# EAGLE design board_V2 (EAGLE 9.3.1)
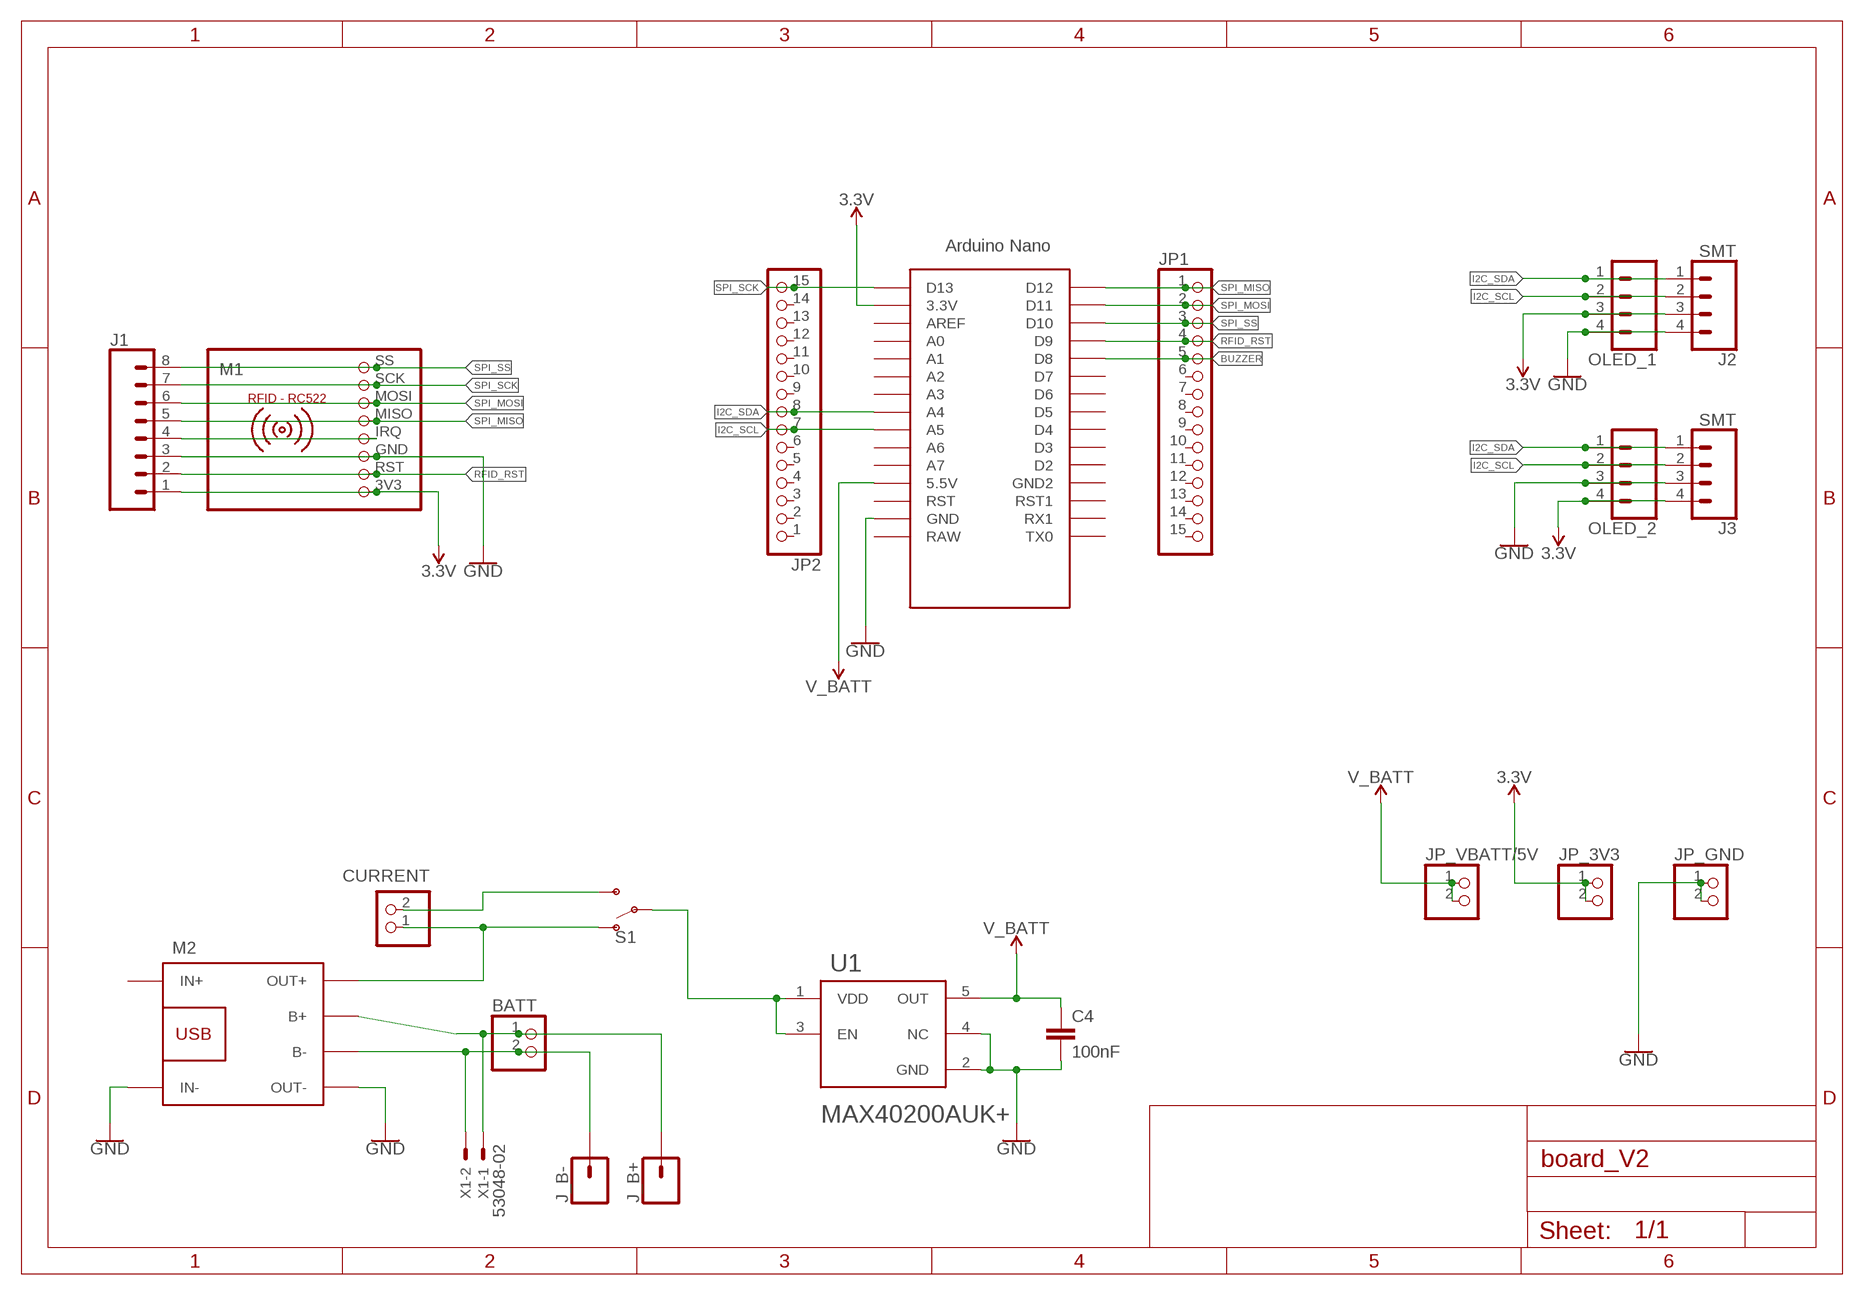
[diagram p0: schematic, sheet 1]

## Parts
BATT  PINHD-1X2  [1X02]
C4  100nF  C-EUC0805  [C0805]
CURRENT  PINHD-1X2  [1X02]
J1  CONN_08SMD-COMBO-FEMALE  [1X08_SMD_COMBINED]
J2  SMT  CONN_04SMD_STRAIGHT_COMBO  [1X04_SMD_VERTICAL_COMBO]
J3  SMT  CONN_04SMD_STRAIGHT_COMBO  [1X04_SMD_VERTICAL_COMBO]
J_B+  CONN_01OFFSET  [1X01_OFFSET]
J_B-  CONN_01OFFSET  [1X01_OFFSET]
JP1  PINHD-1X151X15_SMT  [1X15_SMT]
JP2  PINHD-1X151X15_SMT  [1X15_SMT]
JP_3V3  PINHD-1X2  [1X02]
JP_GND  PINHD-1X2  [1X02]
JP_VBATT/5V  PINHD-1X2  [1X02]
M1  RFID-RC522  [RFID-RC522]
M2  BATTERY-CHARGER-LI-PROT  [BATTERY-CHARGER-LI-PROT]
OLED_1  CONN_04  [1X04]
OLED_2  CONN_04  [1X04]
S1  SWITCH-SPDT-PTH-11.6X4.0MM  [SWITCH_SPDT_PTH_11.6X4.0MM]
U1  MAXIM_ELECTRONICS_MAX40200AUK+MAXIM_ELECTRONICS_MAX40200AUK+_0_0  [MAXIM_ELECTRONICS_MAX40200AUK+_0]
U$1  NANO_ICSP-REMOVED  [NANO_ICSP-REMOVED]
X1  53048-02  [53048-02]

## Nets
3.3V [power]: J1.1 J2.3 J3.4 JP_3V3.1 JP_3V3.2 M1.3V3 OLED_1.3 OLED_2.4 U$1.3.3V
BATT_VOUT [power]: S1.2(P) U1.1(VDD) U1.3(EN)
BUZZER: JP1.5 U$1.D8
GND [power]: C4.2 J1.3 J2.4 J3.3 JP_GND.1 JP_GND.2 M1.GND M2.IN- M2.OUT- OLED_1.4 OLED_2.3 U1.2(GND) U1.4(NC) U$1.GND
I2C_SCL: J2.2 J3.2 JP2.7 OLED_1.2 OLED_2.2 U$1.A5
I2C_SDA: J2.1 J3.1 JP2.8 OLED_1.1 OLED_2.1 U$1.A4
N$1 [power]: BATT.1 J_B+.1 M2.B+ X1.1
N$2 [power]: CURRENT.1 M2.OUT+ S1.1(O)
N$3: J1.4 M1.IRQ
N$4 [power]: CURRENT.2 S1.3(S)
N$5 [power]: BATT.2 J_B-.1 M2.B- X1.2
RFID_RST: J1.2 JP1.4 M1.RST U$1.D9
SPI_MISO: J1.5 JP1.1 M1.MISO U$1.D12
SPI_MOSI: J1.6 JP1.2 M1.MOSI U$1.D11
SPI_SCK: J1.7 JP2.15 M1.SCK U$1.D13
SPI_SS: J1.8 JP1.3 M1.SS U$1.D10
V_BATT [power]: C4.1 JP_VBATT/5V.1 JP_VBATT/5V.2 U1.5(OUT) U$1.5V(5.5V)
Unconnected: JP1.6 JP1.7 JP1.8 JP1.9 JP1.10 JP1.11 JP1.12 JP1.13 JP1.14 JP1.15 JP2.1 JP2.2 JP2.3 JP2.4 JP2.5 JP2.6 JP2.9 JP2.10 JP2.11 JP2.12 JP2.13 JP2.14 M2.IN+ U$1.A0 U$1.A1 U$1.A2 U$1.A3 U$1.A6 U$1.A7 U$1.AREF U$1.D2 U$1.D3 U$1.D4 U$1.D5 U$1.D6 U$1.D7 U$1.GND1(GND2) U$1.RAW U$1.RST U$1.RST1 U$1.RX1 U$1.TX0

## Library data of the parts
BATT CURRENT JP_3V3 JP_GND JP_VBATT/5V = pinhead:PINHD-1X2: PIN HEADER
C4 = rcl:C-EU: CAPACITOR, European symbol; SPICEPREFIX: C
J1 = SparkFun-Connectors:CONN_08: Multi connection point. Often used as Generic Header-pin footprint for 0.1 inch spaced/style header connections On any of the 0.1 inch spaced packages, you can populate with these: Break Away Headers - Straight <https://www.sparkfun.com/products/116> (PRT-00116) Break Away Male Headers - Right Angle <https://www.sparkfun.com/products/553> (PRT-00553) Female Headers <https://www.sparkfun.com/products/115> (PRT-00115) Break Away Headers - Machine Pin <https://www.sparkfun.com/products/117> (PRT-00117) Break Away Female Headers - Swiss Machine Pin <https://www.sparkfun.com/products/743> (PRT-00743) Arduino Stackable Header - 8 Pin <https://www.sparkfun.com/products/9279> (PRT-09279) For SCREWTERMINALS and SPRING TERMINALS visit here: Screw Terimnals on SparkFun.com <https://www.sparkfun.com/search/results?term=Screw+Terminals> (5mm/3.5mm/2.54mm spacing) This device is also useful as a general connection point to wire up your design to another part of your project. Our various solder wires solder well into these plated through hole pads. Hook-Up Wire - Assortment (Stranded, 22 AWG) <https://www.sparkfun.com/products/11375> (PRT-11375) Hook-Up Wire - Assortment (Solid Core, 22 AWG) <https://www.sparkfun.com/products/11367> (PRT-11367) View the entire wire category on our website here <https://www.sparkfun.com/categories/141> Special notes: Molex polarized connector foot print use with SKU : PRT-08231 with associated crimp pins and housings. 1MM SMD Version SKU: PRT-10208 NOTES ON THE VARIANTS LOCK and LOCK_LONGPADS... This footprint was designed to help hold the alignment of a through-hole component (i.e. 6-pin header) while soldering it into place. You may notice that each hole has been shifted either up or down by 0.005 of an inch from it's more standard position (which is a perfectly straight line). This slight alteration caused the pins (the squares in the middle) to touch the edges of the holes. Because they are alternating, it causes a "brace" to hold the component in place. 0.005 has proven to be the perfect amount of "off-center" position when using our standard breakaway headers. Although looks a little odd when you look at the bare footprint, once you have a header in there, the alteration is very hard to notice. Also,if you push a header all the way into place, it is covered up entirely on the bottom side.; PROD_ID: CONN-10204; SF_ID: PRT-11543
J2 J3 = SparkFun-Connectors:CONN_04: Multi connection point. Often used as Generic Header-pin footprint for 0.1 inch spaced/style header connections On any of the 0.1 inch spaced packages, you can populate with these: Break Away Headers - Straight <https://www.sparkfun.com/products/116> (PRT-00116) Break Away Male Headers - Right Angle <https://www.sparkfun.com/products/553> (PRT-00553) Female Headers <https://www.sparkfun.com/products/115> (PRT-00115) Break Away Headers - Machine Pin <https://www.sparkfun.com/products/117> (PRT-00117) Break Away Female Headers - Swiss Machine Pin <https://www.sparkfun.com/products/743> (PRT-00743) For SCREWTERMINALS and SPRING TERMINALS visit here: Screw Terimnals on SparkFun.com <https://www.sparkfun.com/search/results?term=Screw+Terminals> (5mm/3.5mm/2.54mm spacing) This device is also useful as a general connection point to wire up your design to another part of your project. Our various solder wires solder well into these plated through hole pads. Hook-Up Wire - Assortment (Stranded, 22 AWG) <https://www.sparkfun.com/products/11375> (PRT-11375) Hook-Up Wire - Assortment (Solid Core, 22 AWG) <https://www.sparkfun.com/products/11367> (PRT-11367) View the entire wire category on our website here <https://www.sparkfun.com/categories/141> Special notes: Molex polarized connector foot print use with SKU : PRT-08231 with associated crimp pins and housings. 1MM SMD Version SKU: PRT-10208; PROD_ID: CONN-08511; VALUE: 1X04_SMD_STRAIGHT_COMBO
J_B+ J_B- = SparkFun-Connectors:CONN_01: Single connection point. Often used as Generic Header-pin footprint for 0.1 inch spaced/style header connections On any of the 0.1 inch spaced packages, you can populate with these: Break Away Headers - Straight <https://www.sparkfun.com/products/116> (PRT-00116) Break Away Male Headers - Right Angle <https://www.sparkfun.com/products/553> (PRT-00553) Female Headers <https://www.sparkfun.com/products/115> (PRT-00115) Break Away Headers - Machine Pin <https://www.sparkfun.com/products/117> (PRT-00117) Break Away Female Headers - Swiss Machine Pin <https://www.sparkfun.com/products/743> (PRT-00743) This device is also useful as a general connection point to wire up your design to another part of your project. Our various solder wires solder well into these plated through hole pads. Hook-Up Wire - Assortment (Stranded, 22 AWG) <https://www.sparkfun.com/products/11375> (PRT-11375) Hook-Up Wire - Assortment (Solid Core, 22 AWG) <https://www.sparkfun.com/products/11367> (PRT-11367) View the entire wire category on our website here <https://www.sparkfun.com/categories/141> Special notes: SMTSO-256-ET is a "flush mount" nut for a 4-40 screw. We mostly use this on specialty testbeds; it is a nice way to connect hardware to your PCB at an adjustable hieght. Also note, the SNAP packages are for using a snappable style connector. We sell a baggie of snaps and they are also used on two LilyPad designs: Snap Assortment - 30 pack (male and female) <https://www.sparkfun.com/products/11347> (DEV-11347) LilyPad Arduino SimpleSnap <https://www.sparkfun.com/products/10941> (DEV-10941) LilyPad SimpleSnap Protoboard <https://www.sparkfun.com/products/10940> (DEV-10940)
JP1 JP2 = pinhead+:PINHD-1X15: PIN HEADER
M1 = mfrc522-module:RFID-RC522: RFID-RC522 MFRC-522 based breakout board
M2 = diy-modules:BATTERY-CHARGER-LI-PROT: Lithium Battery 5V Charger with protection circuit More details available here: http://www.instructables.com/id/DIY-Lithium-ion-Battery-Charger/step4/TP4056-based-lithium-ion-battery-charger-module/ Click here to find device on ebay.com <http://www.ebay.com/sch/tp4056+charger+usb+protection>
OLED_1 OLED_2 = SparkFun-Connectors:CONN_04: Multi connection point. Often used as Generic Header-pin footprint for 0.1 inch spaced/style header connections On any of the 0.1 inch spaced packages, you can populate with these: Break Away Headers - Straight <https://www.sparkfun.com/products/116> (PRT-00116) Break Away Male Headers - Right Angle <https://www.sparkfun.com/products/553> (PRT-00553) Female Headers <https://www.sparkfun.com/products/115> (PRT-00115) Break Away Headers - Machine Pin <https://www.sparkfun.com/products/117> (PRT-00117) Break Away Female Headers - Swiss Machine Pin <https://www.sparkfun.com/products/743> (PRT-00743) For SCREWTERMINALS and SPRING TERMINALS visit here: Screw Terimnals on SparkFun.com <https://www.sparkfun.com/search/results?term=Screw+Terminals> (5mm/3.5mm/2.54mm spacing) This device is also useful as a general connection point to wire up your design to another part of your project. Our various solder wires solder well into these plated through hole pads. Hook-Up Wire - Assortment (Stranded, 22 AWG) <https://www.sparkfun.com/products/11375> (PRT-11375) Hook-Up Wire - Assortment (Solid Core, 22 AWG) <https://www.sparkfun.com/products/11367> (PRT-11367) View the entire wire category on our website here <https://www.sparkfun.com/categories/141> Special notes: Molex polarized connector foot print use with SKU : PRT-08231 with associated crimp pins and housings. 1MM SMD Version SKU: PRT-10208; PROD_ID: CONN-09696
S1 = SparkFun-Switches:SWITCH-SPDT: Single Pole, Double Throw (SPDT) Switch Single-pole, double-throw (SPDT) switch. Variant Overview SMD-AYZ0202 Surface Mount DPDT Switch <https://www.sparkfun.com/products/597> (COM-00597) Used on e.g. LilyPad Arduino USB - ATmega32U4 Board <https://www.sparkfun.com/products/12049> PTH-11.6X4.0MM SPDT Mini Power Switch <https://www.sparkfun.com/products/102> (COM-00102) Used on e.g. SparkFun Simon Says - Through-Hole Soldering Kit <https://www.sparkfun.com/products/10547> (KIT-10547) PTH-11.6X4.0MM-KIT KIT version of SPDT Mini Power Switch - Simplifies soldering by removing tStop of switch pins - only one side can be soldered. PTH-11.6X4.0MM-LOCK LOCK version of SPDT Mini Power Switch - Offset pins hold switch in place for easier soldering. SMD-RIGHT-ANGLE Surface Mount Right Angle Switch <https://www.sparkfun.com/products/10860> (COM-10860) Used on e.g. SparkFun ESP8266 Thing <https://www.sparkfun.com/products/13231>; PROD_ID: SWCH-08261; SF_SKU: COM-00102
U1 = Maxim Electronics - MAX40200AUK+:MAXIM_ELECTRONICS_MAX40200AUK+: IDEAL DIODE CURRENT SW, 5.5V, SOT23-5; CENTROID_NOT_SPECIFIED: No; DATASHEET: https://datasheets.maximintegrated.com/en/ds/MAX40200.pdf; DEVICE_CLASS_L1: Integrated Circuits (ICs); DEVICE_CLASS_L2: Power Management ICs; DEVICE_CLASS_L3: unset; DIGIKEY_DESCRIPTION: IC DIODE CURRENT SWITCH SOT23-5; DIGIKEY_PART_NUMBER: MAX40200AUK+-ND; FOOTPRINT_URL: https://pdfserv.maximintegrated.com/land_patterns/90-0174.PDF; HEIGHT: 1.45mm; LEAD_FREE: yes; MAX_JUNCTION_TEMP: +150°C; MAX_POWER_DISSIPATION: 312.6mW; MAX_SUPPLY_VOLTAGE: 5.5V; MF: Maxim Electronics; MFG_PACKAGE_IDENT: U5-1; MFG_PACKAGE_IDENT_DATE: 0; MFG_PACKAGE_IDENT_REV: J; MIN_SUPPLY_VOLTAGE: 1.5V; MOUSER_PART_NUMBER: 700-MAX40200AUK+; MPN: MAX40200AUK+; NOMINAL_SUPPLY_CURRENT: 7uA; NUMBER_OF_OUTPUTS: 1; OUTPUT_CURRENT: 1A; PACKAGE: SOT23-5; PREFIX: U; ROHS: yes; STANDOFF_HEIGHT: 0mm; TEMPERATURE_RANGE_HIGH: +125°C; TEMPERATURE_RANGE_LOW: -40°C; VERIFICATION_VERSION: 0.0.0.1
U$1 = Arduino-clone:NANO_ICSP-REMOVED
X1 = con-molex:53?-02: CONNECTOR wire to board 1.25 mm (.049 inch) pitch header; MF: MOLEX; MPN: 53048-0210; OC_FARNELL: 1012259; OC_NEWARK: 57H4718

## Module BUZZER
Ports: 

### Library data of the parts

## Net classes
1 power: width 0.914 mm, clearance 0.254 mm

## Board
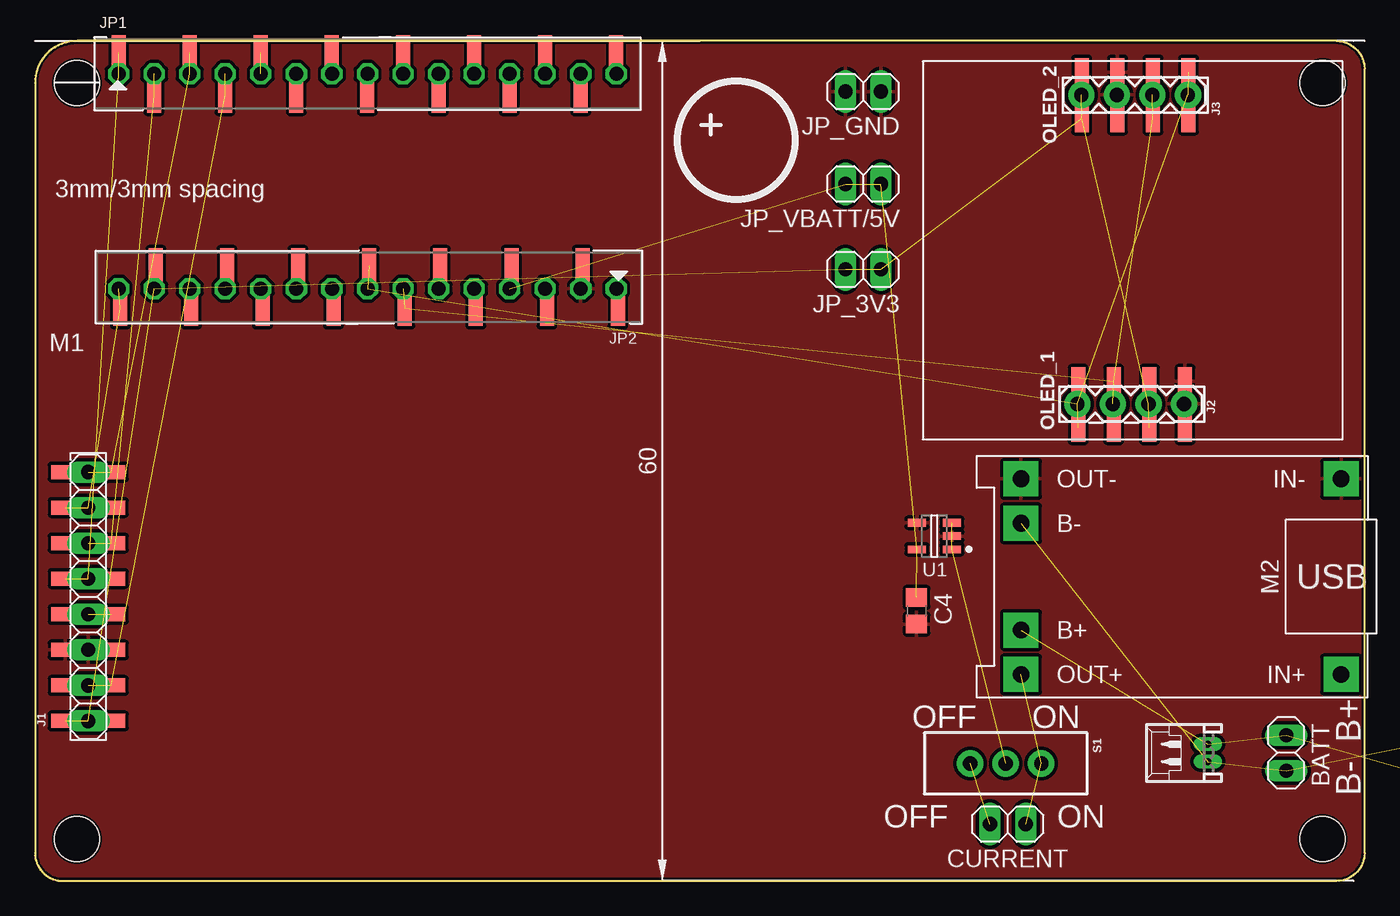
[diagram p1: board, top side]
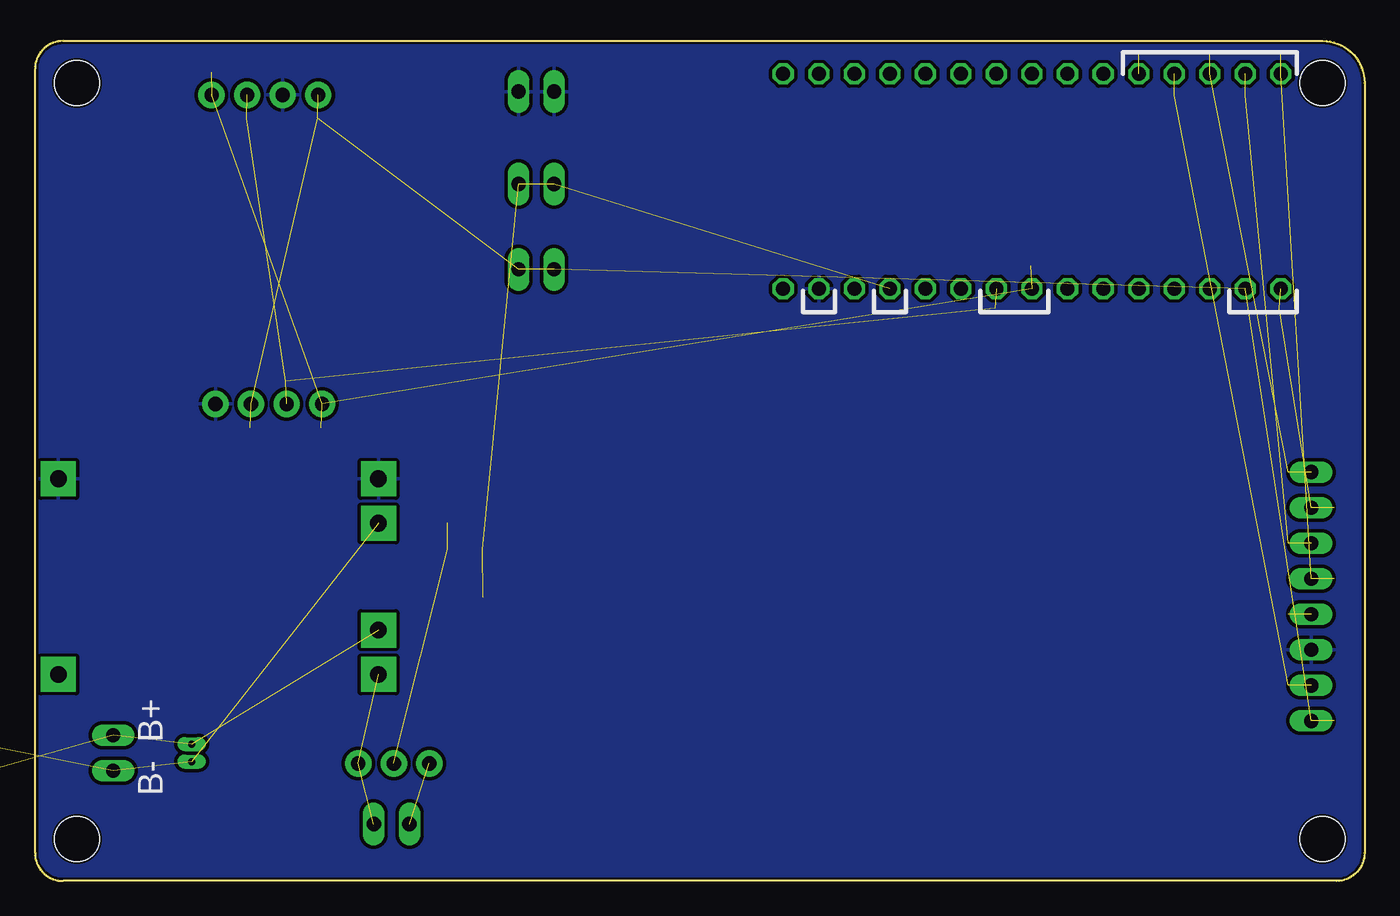
[diagram p2: board, bottom side, seen from below]

Size 95 x 60 mm. Coordinates in mm from the lower left corner, seen from the top.
Outline: 2,0 93,0 arc90 95,2 95,58 arc90 93,60 3,60 arc90 0,57 0,2 arc90 2,0
Copper layers (1*16): Top 0.035mm / dielectric 1.5mm / Bottom 0.035mm
Design rules "default *": minimum track width 6mil, minimum drill 0.35mm, track to track 6mil, track to pad 6mil, pad to pad 6mil, via to via 6mil, smd to smd 6mil, copper to edge 6mil, drill to drill 6mil, minimum pad ring 10mil, minimum via ring 8mil, stop-mask expansion 4mil, vias tented up to drill 0mil, thermal gap 10mil
Holes 3.2 mm at 3,57 3,3 92,3 92,57

### Footprints (pad centres in the part's own frame; a part is rotated, then mirrored left to right if it is on the bottom)
1X02 = drill 1.016 long: 1 -1.27,0; 2 1.27,0
C0805 = smd 1.3 x 1.5: 1 -0.95,0; 2 0.95,0
1X08_SMD_COMBINED = smd 1 x 2: 1 0,1.65; 1@2 0,-1.65; 2 2.54,-1.65; 2@2 2.54,1.65; 3 5.08,1.65; 3@2 5.08,-1.65; 4 7.62,-1.65; 4@2 7.62,1.65; 5 10.16,1.65; 5@2 10.16,-1.65; 6 12.7,-1.65; 6@2 12.7,1.65; 7 15.24,1.65; 7@2 15.24,-1.65; 8 17.78,-1.65; 8@2 17.78,1.65
1X04_SMD_VERTICAL_COMBO = smd 1 x 2: 1 0,-1.65; 1-2 0,1.65; 2 2.54,1.65; 2-2 2.54,-1.65; 3 5.08,-1.65; 3-2 5.08,1.65; 4 7.62,1.65; 4-2 7.62,-1.65
1X01_OFFSET = drill 1.118 pad 1.88 offset: 1 0,0
1X15_SMT = smd 1 x 2.5: 1 -17.78,1.52; 2 -15.24,-1.52; 3 -12.7,1.52; 4 -10.16,-1.52; 5 -7.62,1.52; 6 -5.08,-1.52; 7 -2.54,1.52; 8 0,-1.52; 9 2.54,1.52; 10 5.08,-1.52; 11 7.62,1.52; 12 10.16,-1.52; 13 12.7,1.52; 14 15.24,-1.52; 15 17.78,1.52
RFID-RC522 = drill 1.016 long: 3V3 -8.89,0; GND -3.81,0; IRQ -1.27,0; MISO 1.27,0; MOSI 3.81,0; RST -6.35,0; SCK 6.35,0; SS 8.89,0
BATTERY-CHARGER-LI-PROT = drill 1.2 pad 2.5 square: B+ 10.795,3.81; B- 10.795,-3.81; IN+ -12.065,6.985; IN- -12.065,-6.985; OUT+ 10.795,6.985; OUT- 10.795,-6.985
1X04 = drill 1.016 pad 1.88: 1 0,0; 2 2.54,0; 3 5.08,0; 4 7.62,0
SWITCH_SPDT_PTH_11.6X4.0MM = drill 1.016 pad 1.88: 1 0,2.54; 2 0,0; 3 0,-2.54
MAXIM_ELECTRONICS_MAX40200AUK+_0 = smd 1.3 x 0.55: 1 -1.25,0.95; 2 -1.25,0; 3 -1.25,-0.95; 4 1.25,-0.95; 5 1.25,0.95
NANO_ICSP-REMOVED = drill 1 octagon: 3.3V -10.16,24.13; 5V -10.16,-1.27; A0 -10.16,19.05; A1 -10.16,16.51; A2 -10.16,13.97; A3 -10.16,11.43; A4 -10.16,8.89; A5 -10.16,6.35; A6 -10.16,3.81; A7 -10.16,1.27; AREF -10.16,21.59; D2 5.182,1.27; D3 5.182,3.81; D4 5.182,6.35; D5 5.182,8.89; D6 5.182,11.43; D7 5.182,13.97; D8 5.182,16.51; D9 5.182,19.05; D10 5.182,21.59; D11 5.182,24.13; D12 5.182,26.67; D13 -10.16,26.67; GND -10.16,-6.35; GND1 5.182,-1.27; RAW -10.16,-8.89; RST -10.16,-3.81; RST1 5.182,-3.81; RX1 5.182,-6.35; TX0 5.182,-8.89
53048-02 = drill 0.5 pad 0.698 long: 1 0.625,-1.25; 2 -0.625,-1.25

### Placement (x,y rotation side)
BATT  89.41,9.14 270 top
C4  62.99,19.3 270 top
CURRENT  69.52,4.06 180 top
J1  3.81,11.43 90 top
J2  74.55,34.04 0 top
J3  82.42,56.13 180 top
J_B+  102.87,6.6 90 top  (outside the outline)
J_B-  102.87,10.54 90 top  (outside the outline)
JP1  23.75,57.66 0 top
JP2  23.88,42.42 180 top
JP_3V3  59.18,43.69 180 top
JP_GND  59.18,56.39 180 top
JP_VBATT/5V  59.18,49.78 180 top
M1  3.81,20.32 90 top
M2  81.26,21.74 180 top
OLED_1  74.48,34.08 0 top
OLED_2  82.38,56.15 180 top
S1  69.36,8.4 270 top
U1  64.26,24.64 180 top
U$1  32.65,52.47 90 top
X1  82.55,9.14 90 top

### Tracks (layer width: path | path; a pad name or v marks a point on that pad's centre or on a via)
3.3V  (8 unrouted)
BATT_VOUT  (2 unrouted)
BUZZER  (1 unrouted)
GND
  pour Top: -5.08,66.04 102.06,66.04 102.06,-5.08 -5.08,-5.08
  pour Bottom: -5.08,66.04 102.06,66.04 102.06,-5.08 -5.08,-5.08
I2C_SCL  (5 unrouted)
I2C_SDA  (5 unrouted)
N$1  (3 unrouted)
N$2  (2 unrouted)
N$3  (1 unrouted)
N$4  (1 unrouted)
N$5  (3 unrouted)
RFID_RST  (3 unrouted)
SPI_MISO  (3 unrouted)
SPI_MOSI  (3 unrouted)
SPI_SCK  (3 unrouted)
SPI_SS  (3 unrouted)
V_BATT  (4 unrouted)

### Text on the board
tPlace: 3mm/3mm spacing | OFF | ON | B+ | B- | OFF | ON
bPlace: B+ | B-